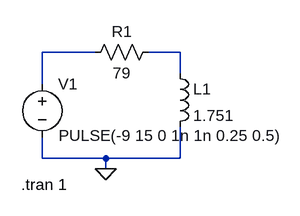
[diagram p0: schematic withkatushka.asc]
withkatushka.asc, the LTspice schematic file:
Version 4
SHEET 1 880 680
WIRE -192 -224 -272 -224
WIRE -64 -224 -112 -224
WIRE -64 -192 -64 -224
WIRE -272 -176 -272 -224
WIRE -272 -64 -272 -96
WIRE -176 -64 -272 -64
WIRE -64 -64 -64 -112
WIRE -64 -64 -176 -64
WIRE -176 -48 -176 -64
FLAG -176 -48 0
SYMBOL res -96 -240 R90
WINDOW 0 0 56 VBottom 2
WINDOW 3 32 56 VTop 2
SYMATTR InstName R1
SYMATTR Value 79
SYMBOL voltage -272 -192 R0
WINDOW 3 25 94 Left 2
WINDOW 123 0 0 Left 0
WINDOW 39 0 0 Left 0
SYMATTR Value PULSE(-9 15 0 1n 1n 0.25 0.5)
SYMATTR InstName V1
SYMBOL ind -80 -208 R0
SYMATTR InstName L1
SYMATTR Value 1.751
TEXT -304 -24 Left 2 !.tran 1

The netlist it stands for:
* withkatushka.asc
R1 N002 N001 79
V1 N001 0 PULSE(-9 15 0 1n 1n 0.25 0.5)
L1 N002 0 1.751
.tran 1
.backanno
.end